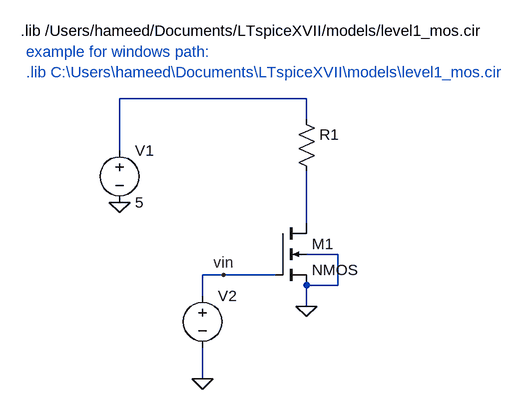
[diagram p0: schematic Assignment3_MOSFET.asc]
Assignment3_MOSFET.asc, the LTspice schematic file:
Version 4
SHEET 1 1028 680
WIRE 512 -128 224 -128
WIRE 512 -96 512 -128
WIRE 224 -48 224 -128
WIRE 512 64 512 -16
WIRE 560 112 512 112
WIRE 384 144 352 144
WIRE 464 144 384 144
WIRE 560 160 560 112
WIRE 560 160 512 160
WIRE 352 176 352 144
WIRE 512 192 512 160
WIRE 352 304 352 256
FLAG 512 192 0
FLAG 352 304 0
FLAG 224 32 0
FLAG 384 144 vin
SYMBOL voltage 352 160 R0
WINDOW 123 24 124 Left 2
WINDOW 39 0 0 Left 0
SYMATTR InstName V2
SYMATTR Value ""
SYMBOL nmos4 464 64 R0
SYMATTR InstName M1
SYMATTR Value2 l=1u w=100u
SYMBOL res 496 -112 R0
SYMATTR InstName R1
SYMATTR Value ""
SYMBOL voltage 224 -64 R0
WINDOW 123 0 0 Left 0
WINDOW 39 0 0 Left 0
SYMATTR InstName V1
SYMATTR Value 5
TEXT 72 -232 Left 2 !.lib /Users/hameed/Documents/LTspiceXVII/models/level1_mos.cir
TEXT 80 -200 Left 2 ;example for windows path:\n.lib C:\\Users\\hameed\\Documents\\LTspiceXVII\\models\\level1_mos.cir

The netlist it stands for:
* Assignment3_MOSFET.asc
V2 vin 0
M1 N002 vin 0 0 NMOS l=1u w=100u
R1 N001 N002
V1 N001 0 5
.model NMOS NMOS
.model PMOS PMOS
.lib standard.mos
.lib /Users/hameed/Documents/LTspiceXVII/models/level1_mos.cir
* example for windows path:
* .lib C:\Users\hameed\Documents\LTspiceXVII\models\level1_mos.cir
.backanno
.end